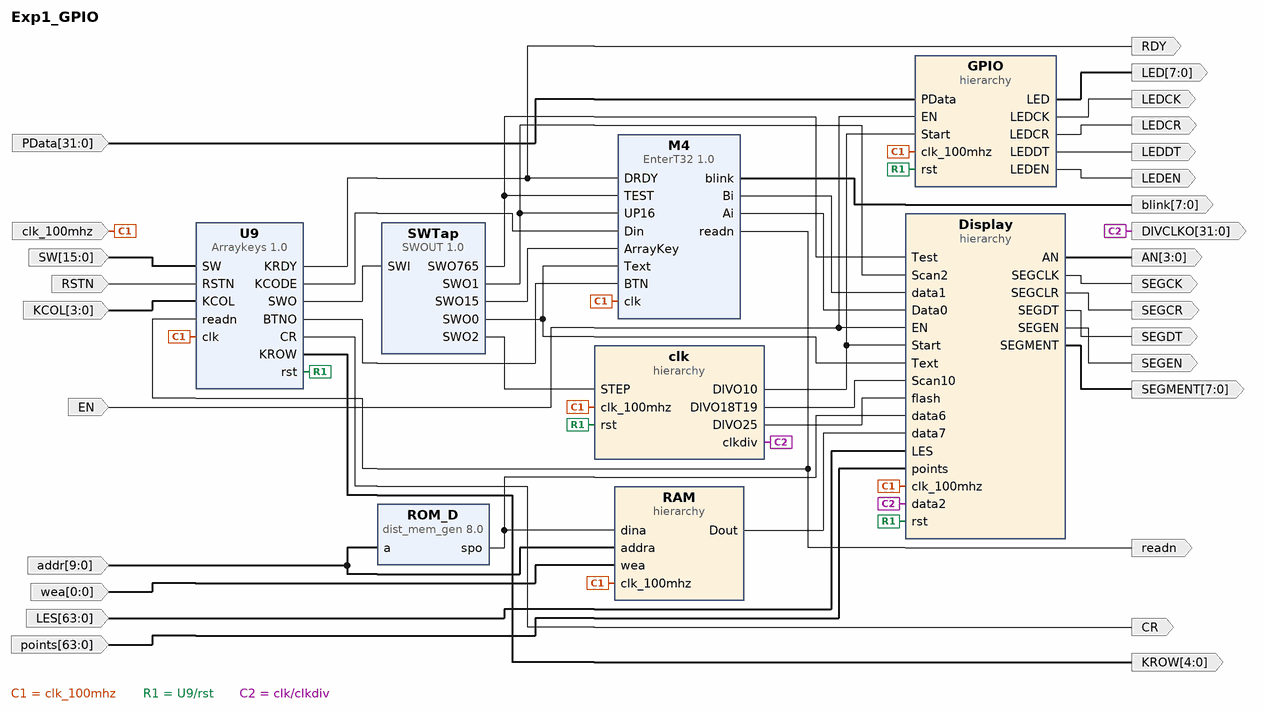
[diagram p0: block diagram of the top level]
# Vivado block design Exp1_GPIO, xc7k160tffg676-2L, Vivado 2017.4
create_bd_design Exp1_GPIO

create_bd_port -dir O CR
create_bd_port -dir O RDY
create_bd_port -dir I -from 15 -to 0 SW
create_bd_port -dir I -type clk clk_100mhz
create_bd_port -dir I RSTN
create_bd_port -dir I -from 3 -to 0 KCOL
create_bd_port -dir O -from 4 -to 0 KROW
create_bd_port -dir O -from 7 -to 0 blink
create_bd_port -dir O readn
create_bd_port -dir O -from 31 -to 0 DIVCLKO
create_bd_port -dir I -from 9 -to 0 addr
create_bd_port -dir I -from 0 -to 0 wea
create_bd_port -dir I EN
create_bd_port -dir I -from 63 -to 0 LES
create_bd_port -dir I -from 63 -to 0 points
create_bd_port -dir O -from 3 -to 0 AN
create_bd_port -dir O -from 7 -to 0 SEGMENT
create_bd_port -dir O SEGEN
create_bd_port -dir O SEGCK
create_bd_port -dir O SEGCR
create_bd_port -dir O SEGDT
create_bd_port -dir O -from 7 -to 0 LED
create_bd_port -dir I -from 31 -to 0 PData
create_bd_port -dir O LEDEN
create_bd_port -dir O LEDCK
create_bd_port -dir O LEDCR
create_bd_port -dir O LEDDT

create_bd_cell -type ip -vlnv ZJUCLIP:user:Arraykeys:1.0 U9
create_bd_cell -type ip -vlnv ZJUCLIP:user:EnterT32:1.0 M4
create_bd_cell -type ip -vlnv ZJUCLIP:user:SWOUT:1.0 SWTap
create_bd_cell -type hier clk
create_bd_cell -type hier RAM
create_bd_cell -type ip -vlnv xilinx.com:ip:dist_mem_gen:8.0 ROM_D
set_property -dict [list \
  CONFIG.depth 1024 \
  CONFIG.data_width 32 \
  CONFIG.memory_type rom \
  CONFIG.coefficient_file ../../../../../../ROM.coe \
] [get_bd_cells ROM_D]
create_bd_cell -type hier Display
create_bd_cell -type hier GPIO

# ---- hierarchy /clk ----
current_bd_instance /clk
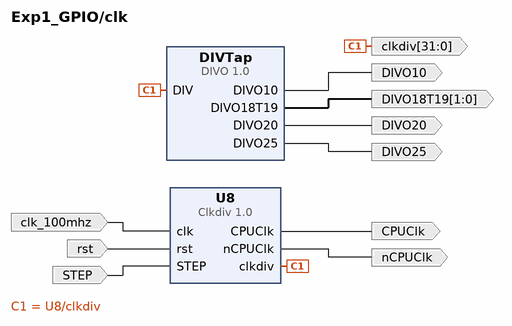
[diagram p1: block diagram inside /clk]
create_bd_pin -dir I -type clk clk_100mhz
create_bd_pin -dir I -type rst rst
create_bd_pin -dir I STEP
create_bd_pin -dir O -from 31 -to 0 clkdiv
create_bd_pin -dir O CPUClk
create_bd_pin -dir O nCPUClk
create_bd_pin -dir O DIVO10
create_bd_pin -dir O -from 1 -to 0 DIVO18T19
create_bd_pin -dir O DIVO20
create_bd_pin -dir O DIVO25

create_bd_cell -type ip -vlnv ZJUCLIP:user:Clkdiv:1.0 U8
create_bd_cell -type ip -vlnv ZJUCLIP:user:DIVO:1.0 DIVTap

# ---- hierarchy /RAM ----
current_bd_instance /RAM
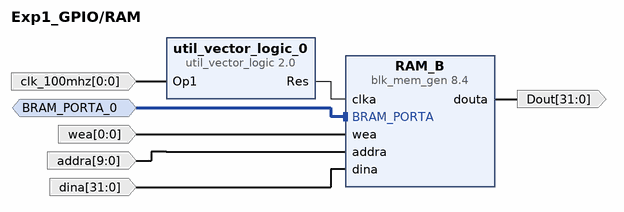
[diagram p2: block diagram inside /RAM]
create_bd_intf_pin -mode Slave -vlnv xilinx.com:interface:bram_rtl:1.0 BRAM_PORTA_0
create_bd_pin -dir I -from 0 -to 0 wea
create_bd_pin -dir I -from 9 -to 0 addra
create_bd_pin -dir I -from 31 -to 0 dina
create_bd_pin -dir O -from 31 -to 0 Dout
create_bd_pin -dir I -from 0 -to 0 clk_100mhz

create_bd_cell -type ip -vlnv xilinx.com:ip:util_vector_logic:2.0 util_vector_logic_0
set_property -dict {CONFIG.C_SIZE 1 CONFIG.C_OPERATION not} [get_bd_cells util_vector_logic_0]
create_bd_cell -type ip -vlnv xilinx.com:ip:blk_mem_gen:8.4 RAM_B
set_property -dict [list \
  CONFIG.Enable_32bit_Address false \
  CONFIG.Use_Byte_Write_Enable false \
  CONFIG.Write_Depth_A 1024 \
  CONFIG.Enable_A Always_Enabled \
  CONFIG.Register_PortA_Output_of_Memory_Primitives true \
  CONFIG.Use_RSTA_Pin false \
  CONFIG.use_bram_block Stand_Alone \
] [get_bd_cells RAM_B]

# ---- hierarchy /Display ----
current_bd_instance /Display
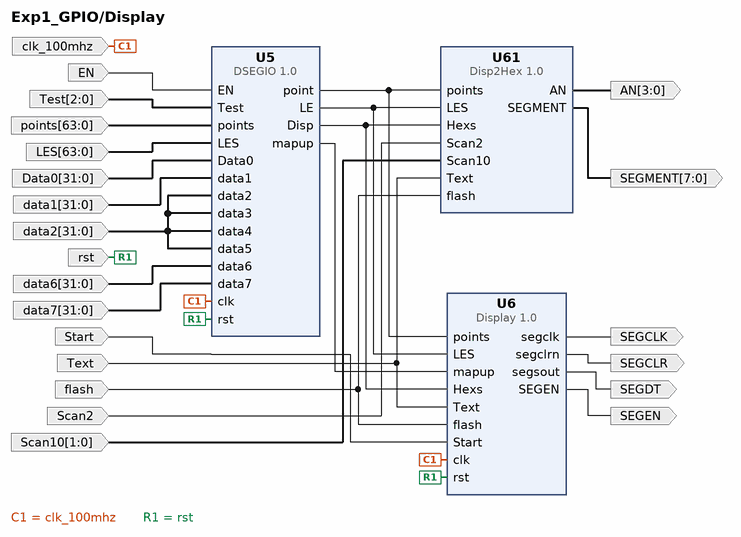
[diagram p3: block diagram inside /Display]
create_bd_pin -dir I -type clk clk_100mhz
create_bd_pin -dir I rst
create_bd_pin -dir I EN
create_bd_pin -dir I -from 2 -to 0 Test
create_bd_pin -dir I -from 63 -to 0 points
create_bd_pin -dir I -from 63 -to 0 LES
create_bd_pin -dir I -from 31 -to 0 Data0
create_bd_pin -dir I -from 31 -to 0 data1
create_bd_pin -dir I -from 31 -to 0 data2
create_bd_pin -dir I -from 31 -to 0 data6
create_bd_pin -dir I -from 31 -to 0 data7
create_bd_pin -dir I Scan2
create_bd_pin -dir I -from 1 -to 0 Scan10
create_bd_pin -dir I Text
create_bd_pin -dir I flash
create_bd_pin -dir O -from 3 -to 0 AN
create_bd_pin -dir O -from 7 -to 0 SEGMENT
create_bd_pin -dir I Start
create_bd_pin -dir O SEGCLK
create_bd_pin -dir O SEGDT
create_bd_pin -dir O SEGEN
create_bd_pin -dir O SEGCLR

create_bd_cell -type ip -vlnv ZJUCLIP:user:DSEGIO:1.0 U5
create_bd_cell -type ip -vlnv ZJUCLIP:user:Disp2Hex:1.0 U61
create_bd_cell -type ip -vlnv ZJUCLIP:user:Display:1.0 U6

# ---- hierarchy /GPIO ----
current_bd_instance /GPIO
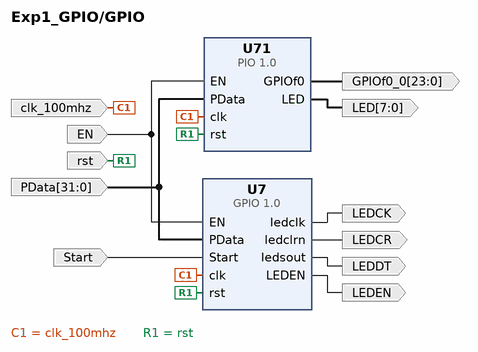
[diagram p4: block diagram inside /GPIO]
create_bd_pin -dir I -type clk clk_100mhz
create_bd_pin -dir I rst
create_bd_pin -dir I EN
create_bd_pin -dir I -from 31 -to 0 PData
create_bd_pin -dir O -from 7 -to 0 LED
create_bd_pin -dir O -from 23 -to 0 GPIOf0_0
create_bd_pin -dir I Start
create_bd_pin -dir O LEDCK
create_bd_pin -dir O LEDDT
create_bd_pin -dir O LEDCR
create_bd_pin -dir O LEDEN

create_bd_cell -type ip -vlnv ZJUCLIP:user:PIO:1.0 U71
create_bd_cell -type ip -vlnv ZJUCLIP:user:GPIO:1.0 U7

# ---- connections ----

current_bd_instance /clk
connect_bd_net -net clk_0_2 [get_bd_pins clk_100mhz] [get_bd_pins U8/clk]
connect_bd_net -net rst_0_1 [get_bd_pins rst] [get_bd_pins U8/rst]
connect_bd_net -net STEP_0_1 [get_bd_pins STEP] [get_bd_pins U8/STEP]
connect_bd_net [get_bd_pins U8/clkdiv] [get_bd_pins clkdiv] [get_bd_pins DIVTap/DIV]
connect_bd_net [get_bd_pins U8/CPUClk] [get_bd_pins CPUClk]
connect_bd_net [get_bd_pins U8/nCPUClk] [get_bd_pins nCPUClk]
connect_bd_net [get_bd_pins DIVTap/DIVO10] [get_bd_pins DIVO10]
connect_bd_net [get_bd_pins DIVTap/DIVO18T19] [get_bd_pins DIVO18T19]
connect_bd_net [get_bd_pins DIVTap/DIVO20] [get_bd_pins DIVO20]
connect_bd_net [get_bd_pins DIVTap/DIVO25] [get_bd_pins DIVO25]

current_bd_instance /RAM
connect_bd_intf_net -intf_net BRAM_PORTA_0_1 [get_bd_intf_pins BRAM_PORTA_0] [get_bd_intf_pins RAM_B/BRAM_PORTA]
connect_bd_net [get_bd_pins util_vector_logic_0/Res] [get_bd_pins RAM_B/clka]
connect_bd_net -net wea_0_1 [get_bd_pins wea] [get_bd_pins RAM_B/wea]
connect_bd_net -net addra_0_1 [get_bd_pins addra] [get_bd_pins RAM_B/addra]
connect_bd_net -net dina_0_1 [get_bd_pins dina] [get_bd_pins RAM_B/dina]
connect_bd_net [get_bd_pins RAM_B/douta] [get_bd_pins Dout]
connect_bd_net -net Op1_0_1 [get_bd_pins clk_100mhz] [get_bd_pins util_vector_logic_0/Op1]

current_bd_instance /Display
connect_bd_net [get_bd_pins U5/point] [get_bd_pins U61/points] [get_bd_pins U6/points]
connect_bd_net [get_bd_pins U5/LE] [get_bd_pins U61/LES] [get_bd_pins U6/LES]
connect_bd_net [get_bd_pins U5/Disp] [get_bd_pins U61/Hexs] [get_bd_pins U6/Hexs]
connect_bd_net [get_bd_pins U5/mapup] [get_bd_pins U6/mapup]
connect_bd_net -net clk_0_2 [get_bd_pins clk_100mhz] [get_bd_pins U6/clk] [get_bd_pins U5/clk]
connect_bd_net -net rst_0_1 [get_bd_pins rst] [get_bd_pins U6/rst] [get_bd_pins U5/rst]
connect_bd_net -net EN_0_1 [get_bd_pins EN] [get_bd_pins U5/EN]
connect_bd_net -net Test_0_1 [get_bd_pins Test] [get_bd_pins U5/Test]
connect_bd_net -net points_0_1 [get_bd_pins points] [get_bd_pins U5/points]
connect_bd_net -net LES_0_1 [get_bd_pins LES] [get_bd_pins U5/LES]
connect_bd_net -net Data0_0_1 [get_bd_pins Data0] [get_bd_pins U5/Data0]
connect_bd_net -net data1_0_1 [get_bd_pins data1] [get_bd_pins U5/data1]
connect_bd_net -net data2_0_1 [get_bd_pins data2] [get_bd_pins U5/data3] [get_bd_pins U5/data4] [get_bd_pins U5/data5] [get_bd_pins U5/data2]
connect_bd_net -net data6_0_1 [get_bd_pins data6] [get_bd_pins U5/data6]
connect_bd_net -net data7_0_1 [get_bd_pins data7] [get_bd_pins U5/data7]
connect_bd_net [get_bd_pins Scan2] [get_bd_pins U61/Scan2]
connect_bd_net -net Scan10_0_1 [get_bd_pins Scan10] [get_bd_pins U61/Scan10]
connect_bd_net -net Text_0_1 [get_bd_pins Text] [get_bd_pins U6/Text] [get_bd_pins U61/Text]
connect_bd_net -net flash_0_1 [get_bd_pins flash] [get_bd_pins U6/flash] [get_bd_pins U61/flash]
connect_bd_net [get_bd_pins U61/AN] [get_bd_pins AN]
connect_bd_net [get_bd_pins U61/SEGMENT] [get_bd_pins SEGMENT]
connect_bd_net -net Start_0_1 [get_bd_pins Start] [get_bd_pins U6/Start]
connect_bd_net [get_bd_pins U6/segclk] [get_bd_pins SEGCLK]
connect_bd_net [get_bd_pins U6/segsout] [get_bd_pins SEGDT]
connect_bd_net [get_bd_pins U6/SEGEN] [get_bd_pins SEGEN]
connect_bd_net [get_bd_pins U6/segclrn] [get_bd_pins SEGCLR]

current_bd_instance /GPIO
connect_bd_net -net clk_0_2 [get_bd_pins clk_100mhz] [get_bd_pins U7/clk] [get_bd_pins U71/clk]
connect_bd_net -net rst_0_1 [get_bd_pins rst] [get_bd_pins U7/rst] [get_bd_pins U71/rst]
connect_bd_net -net EN_0_2 [get_bd_pins EN] [get_bd_pins U7/EN] [get_bd_pins U71/EN]
connect_bd_net -net PData_0_1 [get_bd_pins PData] [get_bd_pins U7/PData] [get_bd_pins U71/PData]
connect_bd_net [get_bd_pins U71/LED] [get_bd_pins LED]
connect_bd_net [get_bd_pins U71/GPIOf0] [get_bd_pins GPIOf0_0]
connect_bd_net -net Start_0_1 [get_bd_pins Start] [get_bd_pins U7/Start]
connect_bd_net [get_bd_pins U7/ledclk] [get_bd_pins LEDCK]
connect_bd_net [get_bd_pins U7/ledsout] [get_bd_pins LEDDT]
connect_bd_net [get_bd_pins U7/ledclrn] [get_bd_pins LEDCR]
connect_bd_net [get_bd_pins U7/LEDEN] [get_bd_pins LEDEN]

current_bd_instance /
connect_bd_net [get_bd_pins U9/CR] [get_bd_ports CR]
connect_bd_net [get_bd_pins U9/KRDY] [get_bd_ports RDY] [get_bd_pins M4/DRDY]
connect_bd_net -net SW_0_1 [get_bd_ports SW] [get_bd_pins U9/SW]
connect_bd_net -net clk_0_1 [get_bd_ports clk_100mhz] \
  [get_bd_pins U9/clk] [get_bd_pins M4/clk] [get_bd_pins clk/clk_100mhz] [get_bd_pins RAM/clk_100mhz] \
  [get_bd_pins Display/clk_100mhz] [get_bd_pins GPIO/clk_100mhz]
connect_bd_net -net RSTN_0_1 [get_bd_ports RSTN] [get_bd_pins U9/RSTN]
connect_bd_net -net KCOL_0_1 [get_bd_ports KCOL] [get_bd_pins U9/KCOL]
connect_bd_net [get_bd_pins U9/KROW] [get_bd_ports KROW]
connect_bd_net [get_bd_pins U9/KCODE] [get_bd_pins M4/Din]
connect_bd_net [get_bd_pins U9/BTNO] [get_bd_pins M4/BTN]
connect_bd_net [get_bd_pins M4/blink] [get_bd_ports blink]
connect_bd_net [get_bd_pins M4/readn] [get_bd_ports readn] [get_bd_pins U9/readn]
connect_bd_net [get_bd_pins U9/SWO] [get_bd_pins SWTap/SWI]
connect_bd_net -net SWOUT_0_SWO15 [get_bd_pins SWTap/SWO15] [get_bd_pins M4/ArrayKey]
connect_bd_net -net SWOUT_0_SWO765 [get_bd_pins SWTap/SWO765] [get_bd_pins M4/TEST] [get_bd_pins Display/Test]
connect_bd_net -net SWOUT_0_SWO1 [get_bd_pins SWTap/SWO1] [get_bd_pins M4/UP16] [get_bd_pins Display/Scan2]
connect_bd_net -net SWOUT_0_SWO0 [get_bd_pins SWTap/SWO0] [get_bd_pins M4/Text] [get_bd_pins Display/Text]
connect_bd_net -net rst_1 [get_bd_pins U9/rst] [get_bd_pins clk/rst] [get_bd_pins Display/rst] [get_bd_pins GPIO/rst]
connect_bd_net -net STEP_1 [get_bd_pins SWTap/SWO2] [get_bd_pins clk/STEP]
connect_bd_net [get_bd_pins clk/clkdiv] [get_bd_ports DIVCLKO] [get_bd_pins Display/data2]
connect_bd_net -net addra_0_1 [get_bd_ports addr] [get_bd_pins ROM_D/a] [get_bd_pins RAM/addra]
connect_bd_net -net wea_0_1 [get_bd_ports wea] [get_bd_pins RAM/wea]
connect_bd_net -net dina_1 [get_bd_pins ROM_D/spo] [get_bd_pins RAM/dina] [get_bd_pins Display/data6]
connect_bd_net -net EN_0_1 [get_bd_ports EN] [get_bd_pins Display/EN] [get_bd_pins GPIO/EN]
connect_bd_net -net LES_0_1 [get_bd_ports LES] [get_bd_pins Display/LES]
connect_bd_net -net points_0_1 [get_bd_ports points] [get_bd_pins Display/points]
connect_bd_net -net U61_AN [get_bd_pins Display/AN] [get_bd_ports AN]
connect_bd_net -net U61_SEGMENT [get_bd_pins Display/SEGMENT] [get_bd_ports SEGMENT]
connect_bd_net -net U6_SEGEN [get_bd_pins Display/SEGEN] [get_bd_ports SEGEN]
connect_bd_net -net U6_segclk [get_bd_pins Display/SEGCLK] [get_bd_ports SEGCK]
connect_bd_net -net U6_segclrn [get_bd_pins Display/SEGCLR] [get_bd_ports SEGCR]
connect_bd_net -net U6_segsout [get_bd_pins Display/SEGDT] [get_bd_ports SEGDT]
connect_bd_net -net Start_1 [get_bd_pins clk/DIVO10] [get_bd_pins Display/Start] [get_bd_pins GPIO/Start]
connect_bd_net -net Scan10_1 [get_bd_pins clk/DIVO18T19] [get_bd_pins Display/Scan10]
connect_bd_net [get_bd_pins RAM/Dout] [get_bd_pins Display/data7]
connect_bd_net [get_bd_pins M4/Bi] [get_bd_pins Display/data1]
connect_bd_net [get_bd_pins M4/Ai] [get_bd_pins Display/Data0]
connect_bd_net [get_bd_pins clk/DIVO25] [get_bd_pins Display/flash]
connect_bd_net -net U71_LED [get_bd_pins GPIO/LED] [get_bd_ports LED]
connect_bd_net -net PData_0_1 [get_bd_ports PData] [get_bd_pins GPIO/PData]
connect_bd_net -net U7_LEDEN [get_bd_pins GPIO/LEDEN] [get_bd_ports LEDEN]
connect_bd_net -net U7_ledclk [get_bd_pins GPIO/LEDCK] [get_bd_ports LEDCK]
connect_bd_net -net U7_ledclrn [get_bd_pins GPIO/LEDCR] [get_bd_ports LEDCR]
connect_bd_net -net U7_ledsout [get_bd_pins GPIO/LEDDT] [get_bd_ports LEDDT]

validate_bd_design
save_bd_design
